# Altium schematic sheet Schematic.SchDoc
size A4; SheetNumber: 1; SheetTotal: 1
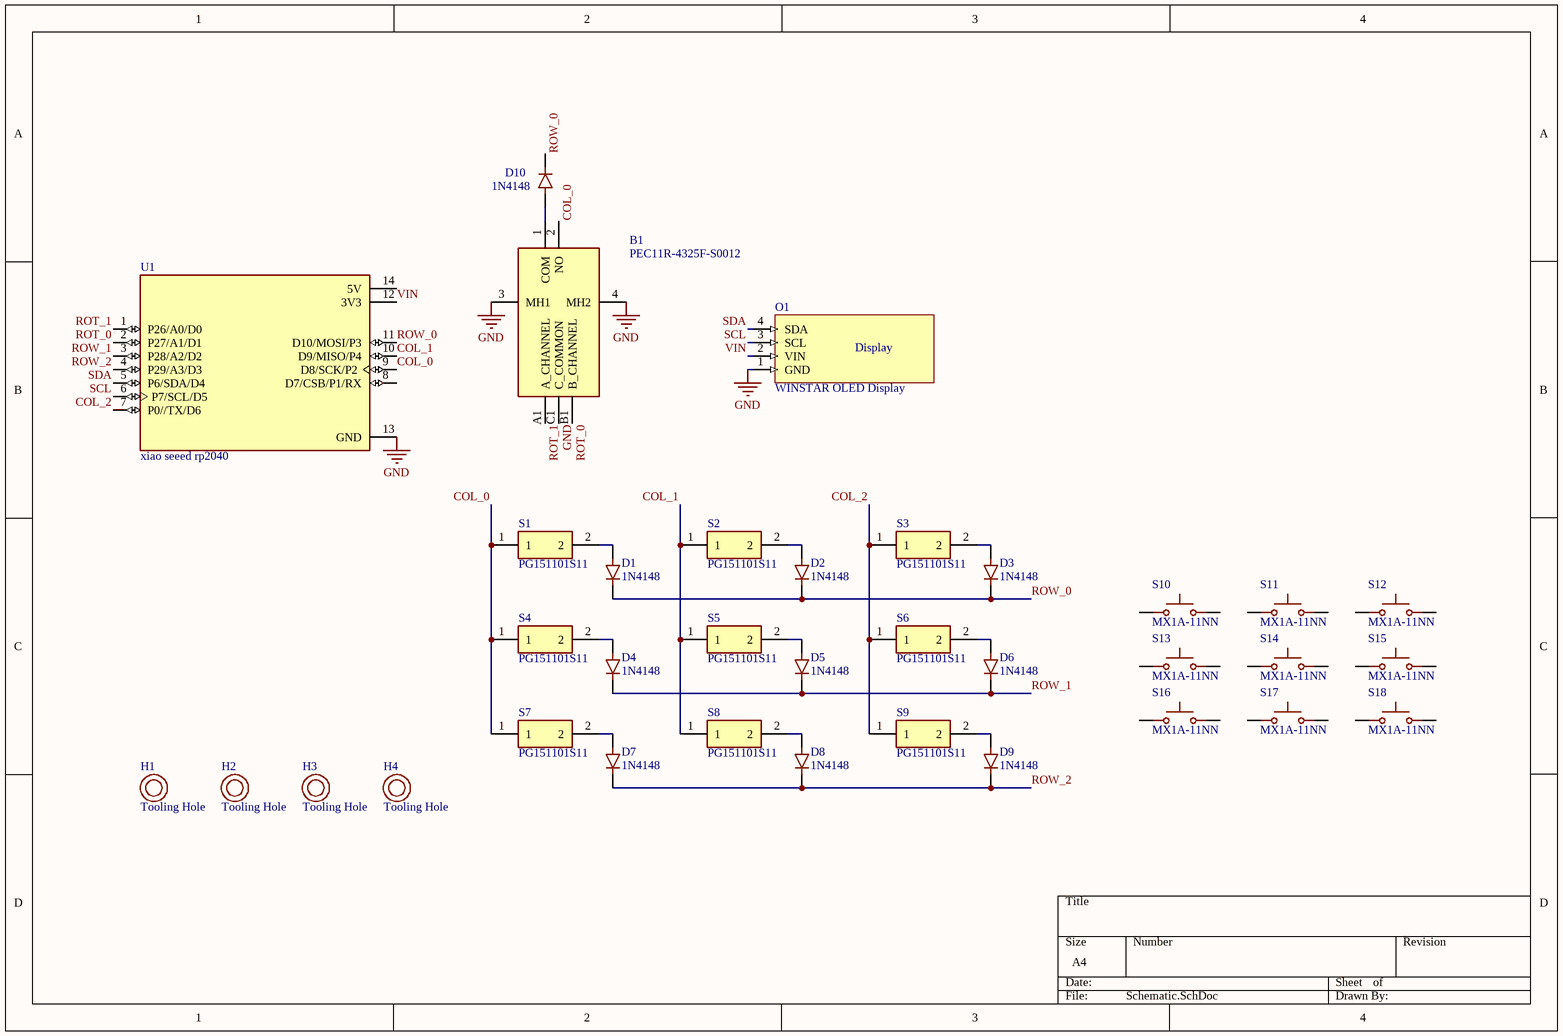
[diagram p0: Schematic.SchDoc]

## Parts
B1  PEC11R-4325F-S0012  [PEC11R-4315F-S0012]
D1  1N4148  [1N4148 Diode]
D2  1N4148  [1N4148 Diode]
D3  1N4148  [1N4148 Diode]
D4  1N4148  [1N4148 Diode]
D5  1N4148  [1N4148 Diode]
D6  1N4148  [1N4148 Diode]
D7  1N4148  [1N4148 Diode]
D8  1N4148  [1N4148 Diode]
D9  1N4148  [1N4148 Diode]
D10  1N4148  [1N4148 Diode]
H1  Tooling Hole  [Tooling Hole]
H2  Tooling Hole  [Tooling Hole]
H3  Tooling Hole  [Tooling Hole]
H4  Tooling Hole  [Tooling Hole]
O1  WINSTAR OLED Display  [WINSTAR OLED Display]
S1  PG151101S11  [SW_PG151101S11]
S2  PG151101S11  [SW_PG151101S11]
S3  PG151101S11  [SW_PG151101S11]
S4  PG151101S11  [SW_PG151101S11]
S5  PG151101S11  [SW_PG151101S11]
S6  PG151101S11  [SW_PG151101S11]
S7  PG151101S11  [SW_PG151101S11]
S8  PG151101S11  [SW_PG151101S11]
S9  PG151101S11  [SW_PG151101S11]
S10  MX1A-11NN  [SW_MX1A-11NN]
S11  MX1A-11NN  [SW_MX1A-11NN]
S12  MX1A-11NN  [SW_MX1A-11NN]
S13  MX1A-11NN  [SW_MX1A-11NN]
S14  MX1A-11NN  [SW_MX1A-11NN]
S15  MX1A-11NN  [SW_MX1A-11NN]
S16  MX1A-11NN  [SW_MX1A-11NN]
S17  MX1A-11NN  [SW_MX1A-11NN]
S18  MX1A-11NN  [SW_MX1A-11NN]
U1  xiao seeed rp2040  [MODULE_102010428]

## Nets
GND: B1.3(MH1) B1.4(MH2) B1.C1(C_COMMON) O1.1(GND) U1.13(GND)
COL_0: B1.2(NO) S1.1 S4.1 S7.1 U1.9(D8/SCK/P2)
COL_1: S2.1 S5.1 S8.1 U1.10(D9/MISO/P4)
COL_2: S3.1 S6.1 S9.1 U1.7(P0//TX/D6)
ROT_0: B1.B1(B_CHANNEL) U1.2(P27/A1/D1)
ROT_1: B1.A1(A_CHANNEL) U1.1(P26/A0/D0)
ROW_0: D1.K D2.K D3.K D10.K U1.11(D10/MOSI/P3)
ROW_1: D4.K D5.K D6.K U1.3(P28/A2/D2)
ROW_2: D7.K D8.K D9.K U1.4(P29/A3/D3)
SCL: O1.3(SCL) U1.6(P7/SCL/D5)
SDA: O1.4(SDA) U1.5(P6/SDA/D4)
VIN: O1.2(VIN) U1.12(3V3)
NetB1_1: B1.1(COM) D10.A
NetD1_A: D1.A S1.2
NetD2_A: D2.A S2.2
NetD3_A: D3.A S3.2
NetD4_A: D4.A S4.2
NetD5_A: D5.A S5.2
NetD6_A: D6.A S6.2
NetD7_A: D7.A S7.2
NetD8_A: D8.A S8.2
NetD9_A: D9.A S9.2

Not connected (* = marked no-connect by the designer): S10 1 2; S11 1 2; S12 1 2; S13 1 2; S14 1 2; S15 1 2; S16 1 2; S17 1 2; S18 1 2; U1 8(D7/CSB/P1/RX) 14(5V)

## Notes on the sheet
- (in symbol WINSTAR OLED Display) Display

## Library data of the parts
B1 = PEC11R-4315F-S0012: Rotary Encoder Mechanical 12 Quadrature (Incremental) Vertical; Manufacturer_Name: Bourns; Geometry.Height: 31.5mm; Manufacturer_Part_Number: PEC11R-4325F-S0012; Mouser Part Number: 652-PEC11R4325FS0012; Mouser Price/Stock: https://www.mouser.co.uk/ProductDetail/Bourns/PEC11R-4325F-S0012?qs=Zq5ylnUbLm4xKJFZnkQTMQ%3D%3D; Arrow Part Number: *; Arrow Price/Stock: *; Datasheet Link: https://www.bourns.com/docs/product-datasheets/pec11r.pdf
D1-D10 = 1N4148: Diode Standard 75V 200mA Surface Mount SOD-523F; MF: ON Semiconductor; SnapEDA_Link: https://www.snapeda.com/parts/1N4148/Onsemi/view-part/?ref=snap; Package: AXIAL LEAD-2 ON Semiconductor; Value: *; MP: 1N4148; Check_prices: https://www.snapeda.com/parts/1N4148/Onsemi/view-part/?ref=eda
O1 = WINSTAR OLED Display: WEA012832FWPP3N00000; ComponentLink1Description: New link; ComponentLink1URL: https://www.soselectronic.com/pl-pl/products/winstar/wea012832fwpp3n00000-401631
S1-S9 = PG151101S11: MF: Kailh; SnapEDA_Link: https://www.snapeda.com/parts/PG151101S11/Kailh/view-part/?ref=snap; Package: Package; Value: *; MP: PG151101S11; Check_prices: https://www.snapeda.com/parts/PG151101S11/Kailh/view-part/?ref=eda
S10-S18 = MX1A-11NN: Switch,Key,SPST-NO,Keyboard,Low Profile,10mA,12VDC,Face Place Mount,Std Force | Cherry Americas MX1A-11NN; SnapEDA_Link: https://www.snapeda.com/parts/MX1A-11NN/Cherry/view-part/?ref=snap; Package: None; Value: *; MF: Cherry; MP: MX1A-11NN; Check_prices: https://www.snapeda.com/parts/MX1A-11NN/Cherry/view-part/?ref=eda
U1 = xiao seeed rp2040: RP2040 XIAO RP2040 series ARMÂ® CortexÂ®-M0+ MCU 32-Bit Embedded Evaluation Board; MF: Seeed Technology Co., Ltd; MP: 102010428; SnapEDA_Link: https://www.snapeda.com/parts/102010428/Seeed+Technology+Co.%252C+Ltd/view-part/?ref=snap; Package: None; Value: *; Check_prices: https://www.snapeda.com/parts/102010428/Seeed+Technology+Co.%252C+Ltd/view-part/?ref=eda